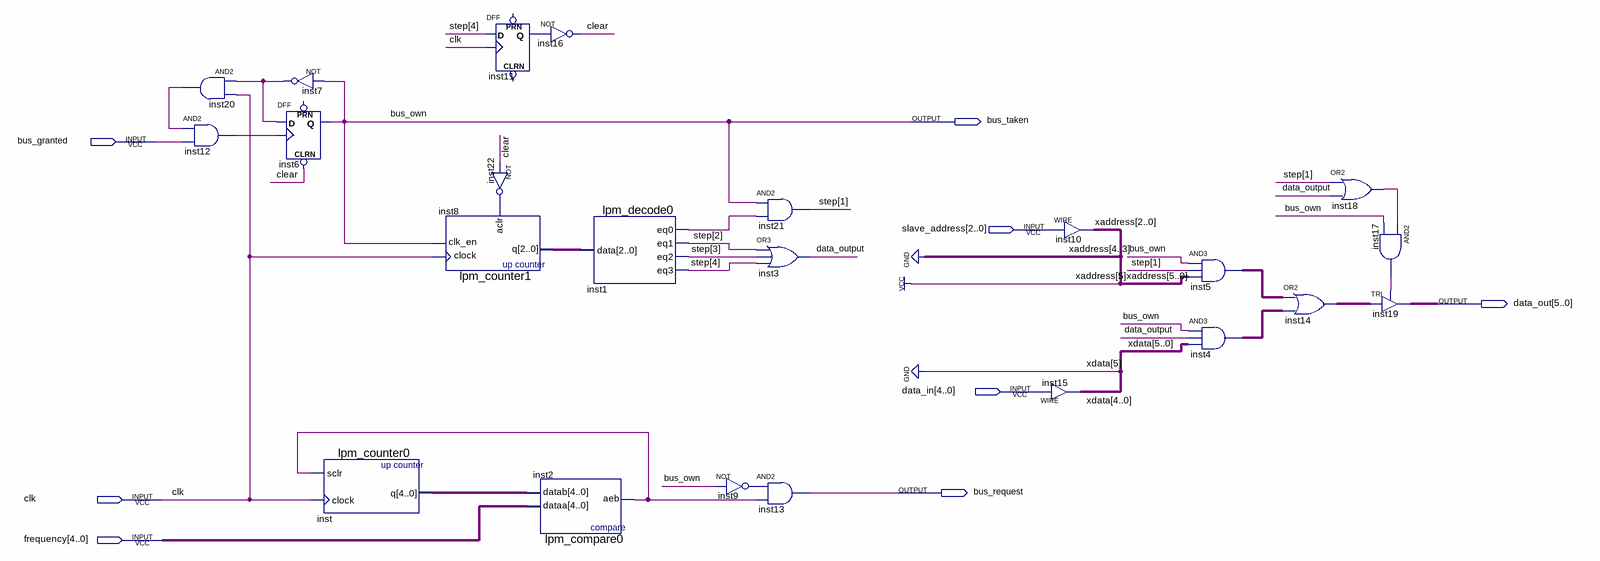
[diagram p0: schematic sheet]
// Quartus schematic MasterDevice.bdf as structural Verilog: 23 symbols, 8 pins
module MasterDevice (
  input  bus_granted,
  input  [2:0] slave_address,
  input  [4:0] data_in,
  input  clk,
  input  [4:0] frequency,
  output bus_taken,
  output [5:0] data_out,
  output bus_request
);

  wire clear, data_output, inst1_eq0, inst2_aeb, inst7_out, inst9_out, inst11_q, inst12_out, inst17_out,
       inst18_out, inst20_out, inst22_out;
  wire [2:0] inst8_q, xaddress;
  wire [4:0] inst_q, xdata;
  wire [4:1] step;
  wire [5:0] inst4_out, inst5_out, inst14_out;

  and inst20 (inst20_out, inst7_out, clk);
  and inst12 (inst12_out, inst20_out, bus_granted);
  not inst7 (inst7_out, bus_taken);
  DFF inst6 (.CLRN(clear), .CLK(inst12_out), .D(inst7_out), .Q(bus_taken));  // open: PRN
  lpm_counter0 inst (.sclr(inst2_aeb), .clock(clk), .q(inst_q));
  lpm_counter1 inst8 (.clock(clk), .clk_en(bus_taken), .aclr(inst22_out), .q(inst8_q));
  DFF inst11 (.CLK(clk), .D(step[4]), .Q(inst11_q));  // open: CLRN, PRN
  not inst22 (inst22_out, clear);
  not inst16 (clear, inst11_q);
  lpm_compare0 inst2 (.dataa(frequency), .datab(inst_q), .aeb(inst2_aeb));
  lpm_decode0 inst1 (.data(inst8_q), .eq0(inst1_eq0), .eq1(step[2]), .eq2(step[3]), .eq3(step[4]));
  not inst9 (inst9_out, bus_taken);
  and inst21 (step[1], bus_taken, inst1_eq0);
  or inst3 (data_output, step[2], step[3], step[4]);
  and inst13 (bus_request, inst9_out, inst2_aeb);
  assign xdata = data_in;  // WIRE inst15
  assign xaddress = slave_address;  // WIRE inst10
  assign inst5_out = {6{bus_taken}} & {6{step[1]}} & {3'b100, xaddress};  // AND3 inst5, 6 bits wide
  assign inst4_out = {6{bus_taken}} & {6{data_output}} & {1'b0, xdata};  // AND3 inst4, 6 bits wide
  assign inst14_out = inst5_out | inst4_out;  // OR2 inst14, 6 bits wide
  or inst18 (inst18_out, step[1], data_output);
  and inst17 (inst17_out, inst18_out, bus_taken);
  TRI inst19[5:0] (.IN(inst14_out), .OE(inst17_out), .OUT(data_out));

  // Other names for the same wires on the sheet: bus_own = bus_taken
endmodule
